# EAGLE design TH (EAGLE 6.3)
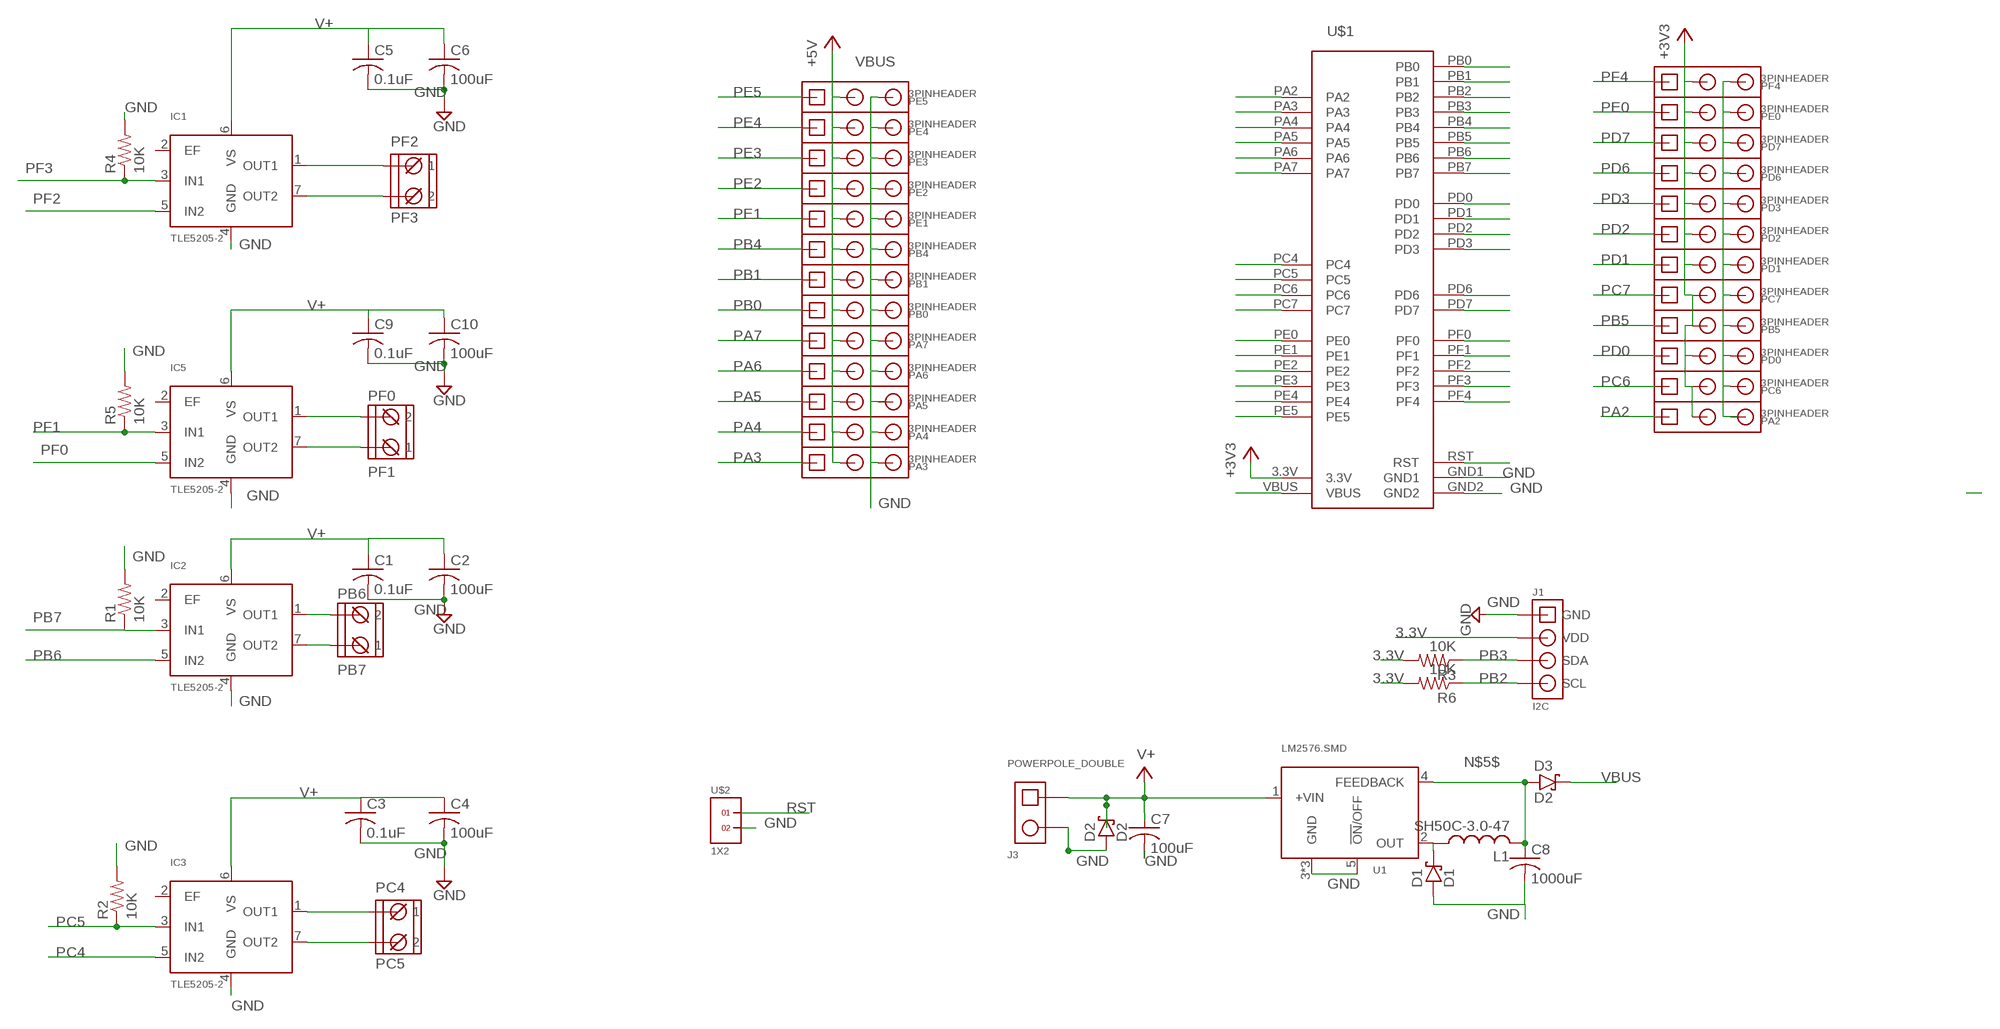
[diagram p0: schematic, sheet 1]

## Parts
C1  0.1uF  C-US025-024X044  [C025-024X044]
C2  100uF  C-US025-024X044  [C025-024X044]
C3  0.1uF  C-US025-024X044  [C025-024X044]
C4  100uF  C-US025-024X044  [C025-024X044]
C5  0.1uF  C-US025-024X044  [C025-024X044]
C6  100uF  C-US025-024X044  [C025-024X044]
C7  100uF  C-US025-050X050  [C025-050X050]
C8  1000uF  C-US025-050X050  [C025-050X050]
C9  0.1uF  C-US025-024X044  [C025-024X044]
C10  100uF  C-US025-024X044  [C025-024X044]
D1  D1  1N5820-D  [DIODE_17MM]
D2  D2  1N5820-D  [DIODE_17MM]
D3  D2  1N5820-D  [DIODE_17MM]
IC1  TLE5205-2  [TO-220-7-11]
IC2  TLE5205-2  [TO-220-7-11]
IC3  TLE5205-2  [TO-220-7-11]
IC5  TLE5205-2  [TO-220-7-11]
J1  I2C  [0.1IN_HEADER_1X4]
J3  POWERPOLE_DOUBLE  [POWERPOLE_DOUBLE]
L1  SH50C-3.0-47  [SH50-C2]
PA2  3PINHEADER  [3PINHEADER]
PA3  3PINHEADER  [3PINHEADER]
PA4  3PINHEADER  [3PINHEADER]
PA5  3PINHEADER  [3PINHEADER]
PA6  3PINHEADER  [3PINHEADER]
PA7  3PINHEADER  [3PINHEADER]
PB0  3PINHEADER  [3PINHEADER]
PB1  3PINHEADER  [3PINHEADER]
PB4  3PINHEADER  [3PINHEADER]
PB5  3PINHEADER  [3PINHEADER]
PB7  PB6  PHOENIXSCREWTERMINAL_2  [PHOENIXSCREWTERMINAL_2]
PC4  PC5  PHOENIXSCREWTERMINAL_2  [PHOENIXSCREWTERMINAL_2]
PC6  3PINHEADER  [3PINHEADER]
PC7  3PINHEADER  [3PINHEADER]
PD0  3PINHEADER  [3PINHEADER]
PD1  3PINHEADER  [3PINHEADER]
PD2  3PINHEADER  [3PINHEADER]
PD3  3PINHEADER  [3PINHEADER]
PD6  3PINHEADER  [3PINHEADER]
PD7  3PINHEADER  [3PINHEADER]
PE0  3PINHEADER  [3PINHEADER]
PE1  3PINHEADER  [3PINHEADER]
PE2  3PINHEADER  [3PINHEADER]
PE3  3PINHEADER  [3PINHEADER]
PE4  3PINHEADER  [3PINHEADER]
PE5  3PINHEADER  [3PINHEADER]
PF1  PF0  PHOENIXSCREWTERMINAL_2  [PHOENIXSCREWTERMINAL_2]
PF2  PF3  PHOENIXSCREWTERMINAL_2  [PHOENIXSCREWTERMINAL_2]
PF4  3PINHEADER  [3PINHEADER]
R1  10K  R-US_0204/7  [0204/7]
R2  10K  R-US_0204/7  [0204/7]
R3  10K  R-US_0204/7  [0204/7]
R4  10K  R-US_0204/7  [0204/7]
R5  10K  R-US_0204/7  [0204/7]
R6  10K  R-US_0204/7  [0204/7]
U1  LM2576.SMD  [KTT0005B]
U$1  STELLARIS-LAUNCHPADSTELLARIS-LAUNCHPAD-XL  [LAUNCHPAD-XL]
U$2  1X2  [1X2]

## Nets
3.3V: J1.2(VDD) PA2.2 PB5.2 PC6.2 PC7.2 PD0.2 PD1.2 PD2.2 PD3.2 PD6.2 PD7.2 PE0.2 PF4.2 R3.2 R6.2 U$1.3.3V ; supply symbol labelled +3V3
GND: C1.2 C2.2 C3.2 C4.2 C5.2 C6.2 C7.2 C8.2 C9.2 C10.2 D1.2(A) D2.2(A) IC1.4(GND) IC2.4(GND) IC3.4(GND) IC5.4(GND) J1.1(GND) J3.2 PA3.3 PA4.3 PA5.3 PA6.3 PA7.3 PB0.3 PB1.3 PB4.3 PB5.3 PC6.3 PC7.3 PD0.3 PD1.3 PD2.3 PD3.3 PD6.3 PD7.3 PE0.3 PE1.3 PE2.3 PE3.3 PE4.3 PE5.3 PF4.3 R1.2 R2.2 R4.2 R5.2 U1.3(GND) U1.5(!ON!/OFF) U1.GROUND(GND) U1.GROUND@1(GND) U$1.GND1 U$1.GND2 U$2.2
N$2: IC2.1(OUT1) PB7.2
N$4: IC2.7(OUT2) PB7.1
N$5$: C8.1 D3.2(A) L1.P$2 U1.4(FEEDBACK)
N$6: IC3.1(OUT1) PC4.1
N$7: IC1.1(OUT1) PF2.1
N$8: IC1.7(OUT2) PF2.2
N$9: IC3.7(OUT2) PC4.2
N$11: D1.1(C) L1.P$1 U1.2(OUT)
N$12: IC5.1(OUT1) PF1.2
N$13: IC5.7(OUT2) PF1.1
PA2: PA2.1 U$1.PA2
PA3: PA3.1 U$1.PA3
PA4: PA4.1 U$1.PA4
PA5: PA5.1 U$1.PA5
PA6: PA6.1 U$1.PA6
PA7: PA7.1 U$1.PA7
PB0: PB0.1 U$1.PB0
PB1: PB1.1 U$1.PB1
PB2: J1.4(SCL) R6.1 U$1.PB2
PB3: J1.3(SDA) R3.1 U$1.PB3
PB4: PB4.1 U$1.PB4
PB5: PB5.1 U$1.PB5
PB6: IC2.5(IN2) U$1.PB6
PB7: IC2.3(IN1) R1.1 U$1.PB7
PC4: IC3.5(IN2) U$1.PC4
PC5: IC3.3(IN1) R2.1 U$1.PC5
PC6: PC6.1 U$1.PC6
PC7: PC7.1 U$1.PC7
PD0: PD0.1 U$1.PD0
PD1: PD1.1 U$1.PD1
PD2: PD2.1 U$1.PD2
PD3: PD3.1 U$1.PD3
PD6: PD6.1 U$1.PD6
PD7: PD7.1 U$1.PD7
PE0: PE0.1 U$1.PE0
PE1: PE1.1 U$1.PE1
PE2: PE2.1 U$1.PE2
PE3: PE3.1 U$1.PE3
PE4: PE4.1 U$1.PE4
PE5: PE5.1 U$1.PE5
PF0: IC5.5(IN2) U$1.PF0
PF1: IC5.3(IN1) R5.1 U$1.PF1
PF2: IC1.5(IN2) U$1.PF2
PF3: IC1.3(IN1) R4.1 U$1.PF3
PF4: PF4.1 U$1.PF4
RST: U$1.RST U$2.1
V+: C1.1 C2.1 C3.1 C4.1 C5.1 C6.1 C7.1 C9.1 C10.1 D2.1(C) IC1.6(VS) IC2.6(VS) IC3.6(VS) IC5.6(VS) J3.1 U1.1(+VIN)
VBUS: D3.1(C) PA3.2 PA4.2 PA5.2 PA6.2 PA7.2 PB0.2 PB1.2 PB4.2 PE1.2 PE2.2 PE3.2 PE4.2 PE5.2 U$1.VBUS ; supply symbol labelled +5V
Unconnected: IC1.2(EF) IC2.2(EF) IC3.2(EF) IC5.2(EF) PA2.3

## Library data of the parts
C1-C10 = resistor:C-US: CAPACITOR, American symbol
D1-D3 = RASEagleLib:1N5820-D: 1N5820-D Schottky Diode
IC1-IC3 IC5 = RASEagleLib:TLE5205-2: TLE5205-2 5-A H-Bridge for DC-Motor Applications
J1 = RASEagleLib:I2C: I2C Connector
J3 = RASEagleLib:POWERPOLE_DOUBLE: Double PowerPole Connector Good for battery connections.
L1 = RASEagleLib:SH50C-3.0-47: Inductor 47uH, 3 A SH50C-3.0-47
PA2-PA7 PB0 PB1 PB4 PB5 PC6 PC7 PD0 PD1-PD3 PD6 PD7 PE0 PE1-PE5 PF4 = RASEagleLib:3PINHEADER: 3 Pin Header 0.1" Headers
PB7 PC4 PF1 PF2 = RASEagleLib:PHOENIXSCREWTERMINAL_2: Phoenix Screw Terminal 2 contacts, 5 mm pitch Terminal: 1934861 Pins: 1933189
R1-R6 = resistor:R-US_: RESISTOR, American symbol
U1 = RASEagleLib:LM2576: LM2576 Step Down Regulator
U$1 = StellarisLaunchPad_Fred:STELLARIS-LAUNCHPAD
U$2 = headers(.1in):1X2

## Board
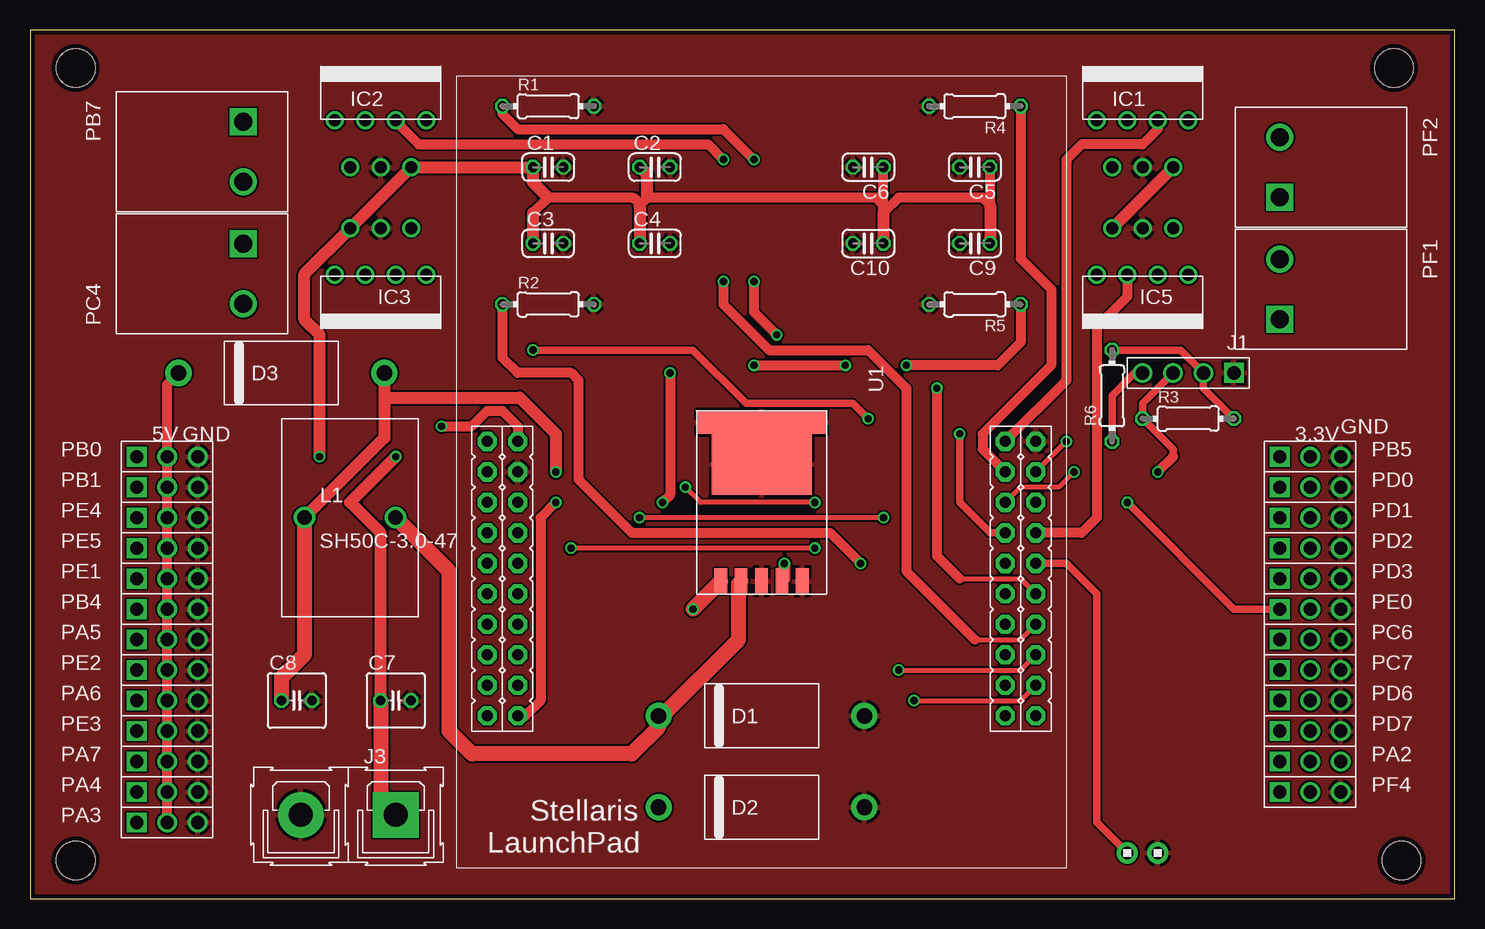
[diagram p1: board, top side]
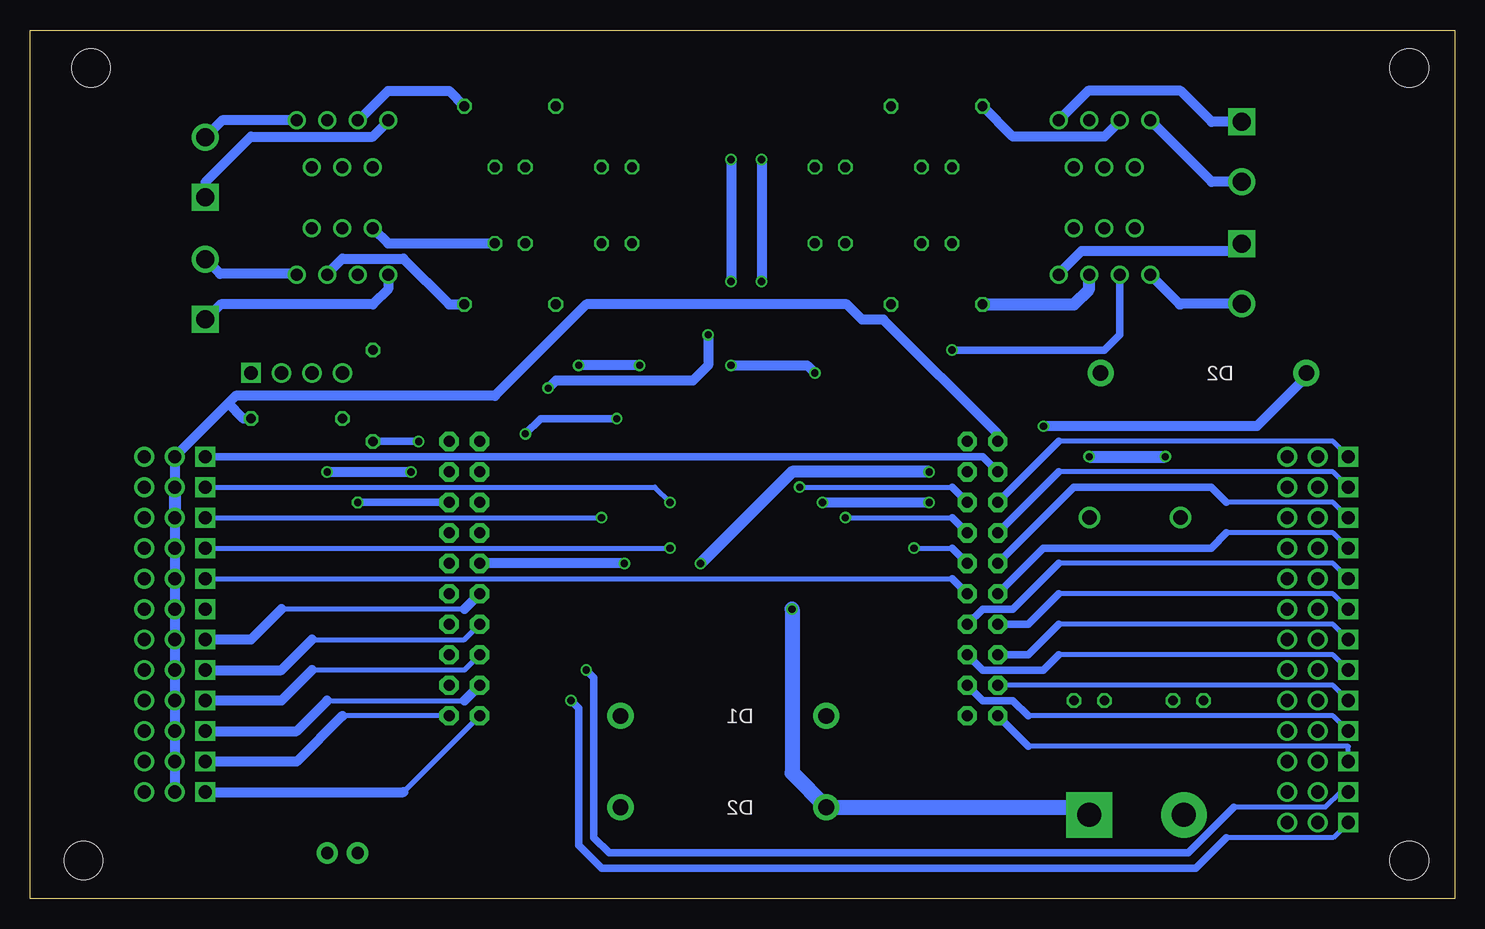
[diagram p2: board, bottom side, seen from below]

Size 118.75 x 72.39 mm. Coordinates in mm from the lower left corner, seen from the top.
Outline: 0,0 118.75,0 118.75,72.39 0,72.39 0,0
Copper layers (1*16): Top 0.0356mm / dielectric 1.5011mm / Bottom 0.0356mm
Design rules "OSHPark": minimum track width 6mil, minimum drill 13mil, track to track 6mil, track to pad 6mil, pad to pad 6mil, via to via 6mil, smd to smd 6mil, copper to edge 15mil, drill to drill 6mil, minimum pad ring 7mil, minimum via ring 7mil, stop-mask expansion 4mil, vias tented up to drill 16mil, thermal gap 10mil
Holes 3.2 mm at 3.81,69.22 3.81,3.17 113.67,69.22 114.3,3.17

### Footprints (pad centres in the part's own frame; a part is rotated, then mirrored left to right if it is on the bottom)
C025-024X044 = drill 0.813 octagon: 1 -1.27,0; 2 1.27,0
C025-050X050 = drill 0.813 octagon: 1 -1.27,0; 2 1.27,0
DIODE_17MM = drill 1.3 pad 2.184: 1 -8.572,0; 2 8.572,0
TO-220-7-11 = drill 1: 1 -3.81,3.9; 2 -2.54,0; 3 -1.27,3.9; 4 0,0; 5 1.27,3.9; 6 2.54,0; 7 3.81,3.9
0.1IN_HEADER_1X4 = drill 1.1 square: 1 -3.81,0 | drill 1.1: 2 -1.27,0; 3 1.27,0; 4 3.81,0
POWERPOLE_DOUBLE = drill 2 pad 3.81 square: 1 0,0 | drill 2 pad 3.81: 2 7.9,0
SH50-C2 = drill 1.2: P$1 3.8,0; P$2 -3.8,0
3PINHEADER = drill 1.1 square: 1 0,0 | drill 1.1: 2 2.54,0; 3 5.08,0
PHOENIXSCREWTERMINAL_2 = drill 1.5 square: 1 -2.5,0 | drill 1.5: 2 2.5,0
0204/7 = drill 0.813 octagon: 1 -3.81,0; 2 3.81,0
KTT0005B = smd 2.159 x 1.067: 1 14.173,-3.404; 2 14.173,-1.702; 3 14.173,0; 4 14.173,1.702; 5 14.173,3.404 | smd 5.08 x 8.331: GROUND 4.445,0 | smd 1.905 x 10.795: GROUND@1 0.953,0
LAUNCHPAD-XL = drill 0.914 pad 1.6 octagon: 3.3V 30.48,2.54; GND1 33.02,5.08; GND2 30.48,48.26; PA2 53.34,48.26; PA3 50.8,48.26; PA4 48.26,48.26; PA5 48.26,2.54; PA6 50.8,2.54; PA7 53.34,2.54; PB0 35.56,2.54; PB1 38.1,2.54; PB2 33.02,48.26; PB3 35.56,45.72; PB4 45.72,2.54; PB5 33.02,2.54; PB6 45.72,48.26; PB7 43.18,48.26; PC4 38.1,45.72; PC5 40.64,45.72; PC6 43.18,45.72; PC7 45.72,45.72; PD0 35.56,5.08; PD1 38.1,5.08; PD2 40.64,5.08; PD3 43.18,5.08; PD6 48.26,45.72; PD7 50.8,45.72; PE0 35.56,48.26; PE1 45.72,5.08; PE2 48.26,5.08; PE3 50.8,5.08; PE4 40.64,2.54; PE5 43.18,2.54; PF0 38.1,48.26; PF1 53.34,5.08; PF2 30.48,45.72; PF3 33.02,45.72; PF4 53.34,45.72; RST 40.64,48.26; VBUS 30.48,5.08
1X2 = drill 1.016 pad 1.778: 1 0,0; 2 2.54,0

### Placement (x,y rotation side)
C1  43.18,60.96 0 top
C2  52.07,60.96 0 top
C3  43.18,54.61 0 top
C4  52.07,54.61 0 top
C5  78.74,60.96 180 top
C6  69.85,60.96 180 top
C7  30.48,16.51 0 top
C8  22.23,16.51 0 top
C9  78.74,54.61 180 top
C10  69.85,54.61 180 top
D1  60.96,15.24 0 top
D2  60.96,7.62 0 top
D3  20.95,43.81 0 top
IC1  92.71,60.96 0 top
IC2  29.21,60.96 0 top
IC3  29.21,55.88 180 top
IC5  92.71,55.88 180 top
J1  96.52,43.81 180 top
J3  30.48,6.99 180 top
L1  26.67,31.75 0 top
PA2  104.14,11.43 0 top
PA3  8.89,6.35 0 top
PA4  8.89,8.89 0 top
PA5  8.89,21.59 0 top
PA6  8.89,16.51 0 top
PA7  8.89,11.43 0 top
PB0  8.89,36.83 0 top
PB1  8.89,34.29 0 top
PB4  8.89,24.13 0 top
PB5  104.14,36.83 0 top
PB7  17.78,62.23 270 top
PC4  17.78,52.07 270 top
PC6  104.14,21.59 0 top
PC7  104.14,19.05 0 top
PD0  104.14,34.29 0 top
PD1  104.14,31.75 0 top
PD2  104.14,29.21 0 top
PD3  104.14,26.67 0 top
PD6  104.14,16.51 0 top
PD7  104.14,13.97 0 top
PE0  104.14,24.13 0 top
PE1  8.89,26.67 0 top
PE2  8.89,19.05 0 top
PE3  8.89,13.97 0 top
PE4  8.89,31.75 0 top
PE5  8.89,29.21 0 top
PF1  104.14,50.8 90 top
PF2  104.14,60.96 90 top
PF4  104.14,8.89 0 top
R1  43.18,66.04 0 top
R2  43.18,49.53 0 top
R3  96.52,40.01 0 top
R4  78.74,66.04 180 top
R5  78.74,49.53 180 top
R6  90.17,41.91 90 top
U1  60.96,40.64 270 top
U$1  35.56,68.58 270 top
U$2  91.44,3.81 0 top

### Tracks (layer width: path | path; a pad name or v marks a point on that pad's centre or on a via)
3.3V
  Top 0.61: R6.2 95.89,45.72 J1.2 97.79,42.55 R3.2
  Bottom 0.813: 106.68,31.11 PD1.2 PD2.2 PD3.2 PE0.2 PC6.2 PC7.2 PD6.2 PD7.2 PA2.2 PF4.2 | PD0.2 PB5.2 102.23,41.27 | 102.23,41.27 101.6,41.91 80.01,41.91 72.39,49.53 50.67,49.53 49.4,48.26 47.62,48.26 38.1,38.73 U$1.3.3V | R3.2 100.97,40.01 102.23,41.27
  Bottom 1.016: PD0.2 PD1.2
GND
  pour Top: 0,72.39 0,0 118.75,0.64 118.75,72.39
N$2
  Bottom 0.813: PB7.2 20.27,59.73 IC2.1
N$4
  Bottom 0.813: PB7.1 20.28,64.73 22.86,67.31 30.57,67.31 IC2.7
N$5$  (via drill 0.6)
  Top 1.016: D3.2 29.53,41.76 | 29.53,41.76 29.53,38.41 L1.P$2 | 29.53,41.76 40.79,41.76 43.81,38.73 v43.81,35.56 | v62.87,27.94 62.87,26.67 U1.4
  Top 1.27: L1.P$2 22.87,20.33 20.95,18.41 C8.1
  Bottom 1.016: v43.81,35.56 55.24,35.56 v62.87,27.94
N$6
  Bottom 0.813: IC3.1 33.02,52.07 31.12,53.98 18.38,53.98 PC4.1
N$7
  Bottom 0.61: 88.9,64.77 IC1.1
  Bottom 0.813: 88.9,64.77 90.17,63.5 100.33,63.5 104.14,59.69 PF2.1
N$8
  Bottom 0.813: IC1.7 102.74,64.86 PF2.2
N$9
  Bottom 0.813: IC3.7 22.95,49.53 22.86,49.53 22.82,49.57 PC4.2
N$11
  Top 1.27: L1.P$1 34.92,27.29 34.92,13.97 36.83,12.07 50.16,12.07 52.39,14.29 D1.1 52.7,15.24 59.05,21.59 59.05,26.26 U1.2
N$12
  Bottom 0.61: 96.52,52.07 IC5.1
  Bottom 0.813: 96.52,52.07 102.91,52.07 PF1.2
N$13
  Bottom 0.813: IC5.7 88.9,50.8 90.17,49.53 102.87,49.53 104.14,48.26 PF1.1
PA2
  Bottom 0.406: U$1.PA2 92.71,15.24
  Bottom 0.813: 92.71,15.24 96.52,11.43 PA2.1
PA3  (via drill 0.6)
  Top 0.406: v73.66,16.51 82.55,16.51 U$1.PA3
  Bottom 0.406: PA3.1 10.16,5.08 19.05,5.08
  Bottom 0.61: 19.05,5.08 21.59,2.54 71.12,2.54 73.03,4.45 73.03,15.88 v73.66,16.51
PA4  (via drill 0.6)
  Top 0.406: v72.39,19.05 82.55,19.05 U$1.PA4
  Bottom 0.406: PA4.1 9.53,8.89 10.79,7.62 18.41,7.62
  Bottom 0.61: 18.41,7.62 22.23,3.81 70.48,3.81 71.75,5.08 71.75,18.41 v72.39,19.05
PA5
  Bottom 0.406: PA5.1 10.16,22.86 33.02,22.86
  Bottom 0.61: 33.02,22.86 35.56,20.32 U$1.PA5
PA6
  Bottom 0.406: PA6.1 10.16,17.78 U$1.PA6
PA7
  Bottom 0.406: PA7.1 8.89,12.7 35.56,12.7
  Bottom 0.61: 35.56,12.7 U$1.PA7
PB0
  Bottom 0.406: PB0.1 10.16,38.1 33.02,38.1
  Bottom 0.61: 33.02,38.1 U$1.PB0
PB1
  Bottom 0.406: PB1.1 10.16,35.56 33.02,35.56
  Bottom 0.61: 33.02,35.56 U$1.PB1
PB2  (via drill 0.6)
  Top 0.406: v86.36,38.1 U$1.PB2
  Top 0.61: R6.1 90.17,41.91 92.08,43.81 J1.4
  Bottom 0.61: v86.36,38.1 R6.1
PB3  (via drill 0.6)
  Top 0.406: v87,35.56 85.72,34.29 82.55,34.29 U$1.PB3
  Top 0.61: 95.25,36.83 95.25,37.46 R3.1 92.71,41.27 J1.3
  Top 0.813: 95.25,36.83 v93.98,35.56
  Bottom 0.813: v93.98,35.56 v87,35.56
PB4
  Bottom 0.406: PB4.1 10.16,25.4 33.02,25.4
  Bottom 0.61: 33.02,25.4 35.56,22.86 U$1.PB4
PB5
  Bottom 0.61: PB5.1 39.37,36.83 U$1.PB5
PB6  (via drill 0.6)
  Top 0.406: 78.74,21.59 82.55,21.59 U$1.PB6
  Top 0.813: IC2.5 30.48,64.77 32.39,62.87 56.52,62.87 v57.79,61.59 | v57.79,51.44 57.79,49.53 61.59,45.72 69.85,45.72 73.03,42.55 73.03,27.3 78.74,21.59
  Bottom 0.813: v57.79,61.59 v57.79,51.44
PB7  (via drill 0.6)
  Top 0.406: 77.47,26.67 82.55,26.67 U$1.PB7
  Top 0.813: R1.1 39.37,65.41 40.64,64.14 57.79,64.14 v60.33,61.59 | v60.33,51.44 60.33,48.89 v62.23,46.99 | v75.56,42.55 75.56,28.57 77.47,26.67
  Bottom 0.813: IC2.3 27.94,64.77 29.21,63.5 36.83,63.5 R1.1 | v60.33,61.59 v60.33,51.44 | v62.23,46.99 62.23,44.45 63.5,43.18 74.93,43.18 v75.56,42.55
PC4  (via drill 0.6)
  Top 0.61: v41.91,45.72 55.24,45.72 59.69,41.27 68.58,41.27 v69.85,40.01 | v77.47,38.73 77.47,33.02 80.01,30.48 U$1.PC4
  Bottom 0.61: IC3.5 27.94,46.99 29.21,45.72 v41.91,45.72 | v69.85,40.01 76.2,40.01 v77.47,38.73
PC5  (via drill 0.6)
  Top 0.813: R2.1 39.37,45.09 40.64,43.81 45.09,43.81 45.72,43.18 45.72,34.92 50.16,30.48 66.67,30.48 v69.22,27.94
  Bottom 0.813: IC3.3 30.55,52 | v69.22,27.94 U$1.PC5
  Bottom 1.016: R2.1 31.75,49.53 30.48,50.8 IC3.3
PC6
  Bottom 0.406: 82.55,24.13 97.79,24.13
  Bottom 0.813: U$1.PC6 82.55,24.13 | 97.79,24.13 100.33,21.59 PC6.1
PC7
  Bottom 0.406: 95.25,21.59 82.55,21.59 U$1.PC7
  Bottom 0.813: PC7.1 97.79,19.05 95.25,21.59
PD0  (via drill 0.6)
  Top 0.406: v65.41,33.02 55.88,33.02 v54.61,34.29
  Bottom 0.406: PD0.1 66.67,34.29 v65.41,33.02 | v54.61,34.29 41.91,34.29
  Bottom 0.61: 41.91,34.29 U$1.PD0
PD1  (via drill 0.6)
  Top 0.406: v71.12,31.75 v50.8,31.75
  Bottom 0.406: PD1.1 v71.12,31.75 | v50.8,31.75 41.91,31.75
  Bottom 0.61: 41.91,31.75 U$1.PD1
PD2  (via drill 0.6)
  Top 0.406: v65.41,29.21 v45.09,29.21
  Bottom 0.406: PD2.1 v65.41,29.21 | v45.09,29.21 41.91,29.21
  Bottom 0.61: 41.91,29.21 U$1.PD2
PD3
  Bottom 0.406: PD3.1 41.91,26.67
  Bottom 0.61: 41.91,26.67 U$1.PD3
PD6
  Bottom 0.406: U$1.PD6 82.55,19.05 95.25,19.05
  Bottom 0.813: 95.25,19.05 97.79,16.51 PD6.1
PD7
  Bottom 0.406: 93.98,16.51 82.55,16.51
  Bottom 0.813: PD7.1 96.52,13.97 93.98,16.51 | 82.55,16.51 U$1.PD7
PE0  (via drill 0.6)
  Top 0.61: PE0.1 100.33,24.13 v91.44,33.02
  Bottom 0.61: v91.44,33.02 U$1.PE0
PE1
  Bottom 0.406: PE1.1 10.16,27.94 33.02,27.94
  Bottom 0.61: 33.02,27.94 36.83,24.13 39.37,24.13 U$1.PE1
PE2
  Bottom 0.406: PE2.1 10.16,20.32 33.02,20.32
  Bottom 0.61: 33.02,20.32 34.29,19.05 39.37,19.05 U$1.PE2
PE3
  Bottom 0.406: PE3.1 10.16,15.24 35.56,15.24
  Bottom 0.61: 35.56,15.24 36.83,16.51 39.37,16.51 U$1.PE3
PE4
  Bottom 0.406: PE4.1 10.16,33.02 19.05,33.02
  Bottom 0.61: 19.05,33.02 20.32,34.29 31.75,34.29 U$1.PE4
PE5
  Bottom 0.406: PE5.1 10.16,30.48 19.05,30.48
  Bottom 0.61: 19.05,30.48 20.32,29.21 34.29,29.21 U$1.PE5
PF0
  Top 0.813: IC5.5 91.44,50.16 88.9,47.62 88.9,31.75 87.63,30.48 U$1.PF0
PF1  (via drill 0.6)
  Top 0.813: R5.1 82.55,46.35 80.64,44.45 v73.03,44.45 | v53.34,43.81 53.34,33.66 v52.7,33.02 | v43.81,33.02 42.55,31.75 42.55,16.51 41.27,15.24 U$1.PF1 | v60.33,44.45 v67.94,44.45
  Bottom 0.813: IC5.3 93.98,52.07 92.71,53.34 87.63,53.34 83.82,49.53 R5.1 | v60.33,44.45 53.98,44.45 v53.34,43.81 | v52.7,33.02 v43.81,33.02 | v67.94,44.45 v73.03,44.45
PF2
  Top 0.813: IC1.5 93.98,64.14 92.71,62.87 87.63,62.87 86.36,61.59 86.36,43.18 U$1.PF2
PF3
  Top 0.813: R4.1 82.55,53.34 85.09,50.8 85.09,44.45 79.38,38.73 79.38,37.46 U$1.PF3
  Bottom 0.813: IC1.3 91.35,64.86 88.9,67.31 83.82,67.31 R4.1
PF4
  Bottom 0.406: 87.63,8.89 U$1.PF4
  Bottom 0.813: PF4.1 87.63,8.89
RST
  Top 0.61: U$1.RST 86.36,27.94 88.9,25.4 88.9,6.35 U$2.1
V+  (via drill 0.6)
  Top 0.813: C5.1 80.01,57.78 79.38,58.42 72.39,58.42 71.12,57.15 71.12,57.78 | 71.12,57.78 C6.1 | 71.12,57.78 70.48,58.42 51.44,58.42 50.8,57.78 arc60 50.16,58.42 43.18,58.42 41.91,57.15
  Top 1.016: C7.1 29.21,30.48 26.67,33.02 v30.48,36.83 | v24.13,36.83 24.13,46.99 22.86,48.26 22.86,52.07 IC3.6 IC2.6 C1.1 41.91,59.69 43.18,58.42 | 41.91,57.15 C3.1 | 51.44,58.42 51.44,60.32 C2.1 | 50.8,57.78 C4.1 | 71.12,57.15 C10.1 | 80.01,57.78 C9.1 | IC1.6 IC5.6
  Top 1.27: U1.1 57.56,26.44 v55.24,24.13 | C7.1 29.21,8.25 J3.1
  Bottom 0.813: IC5.6 88.9,54.61 C9.1
  Bottom 1.016: v30.48,36.83 v24.13,36.83
  Bottom 1.27: v55.24,24.13 55.24,10.48 D2.1 31.12,7.62 J3.1
VBUS  (via drill 0.6)
  Top 0.813: PA3.2 PA4.2 PA7.2 PE3.2 PA6.2 PE2.2 PA5.2 PB4.2 PE1.2 PE5.2 PE4.2 PB1.2 PB0.2 11.43,42.86 D3.1 | v34.29,39.37 36.83,39.37 38.1,40.64 39.37,40.64 40.64,39.37 U$1.VBUS
  Bottom 0.813: D3.1 12.38,43.5 16.51,39.37 v34.29,39.37

### Text on the board
tPlace: Stellaris / LaunchPad
tNames: 5V | GND | 3.3V | GND